# Altium project CPS.PrjPcb
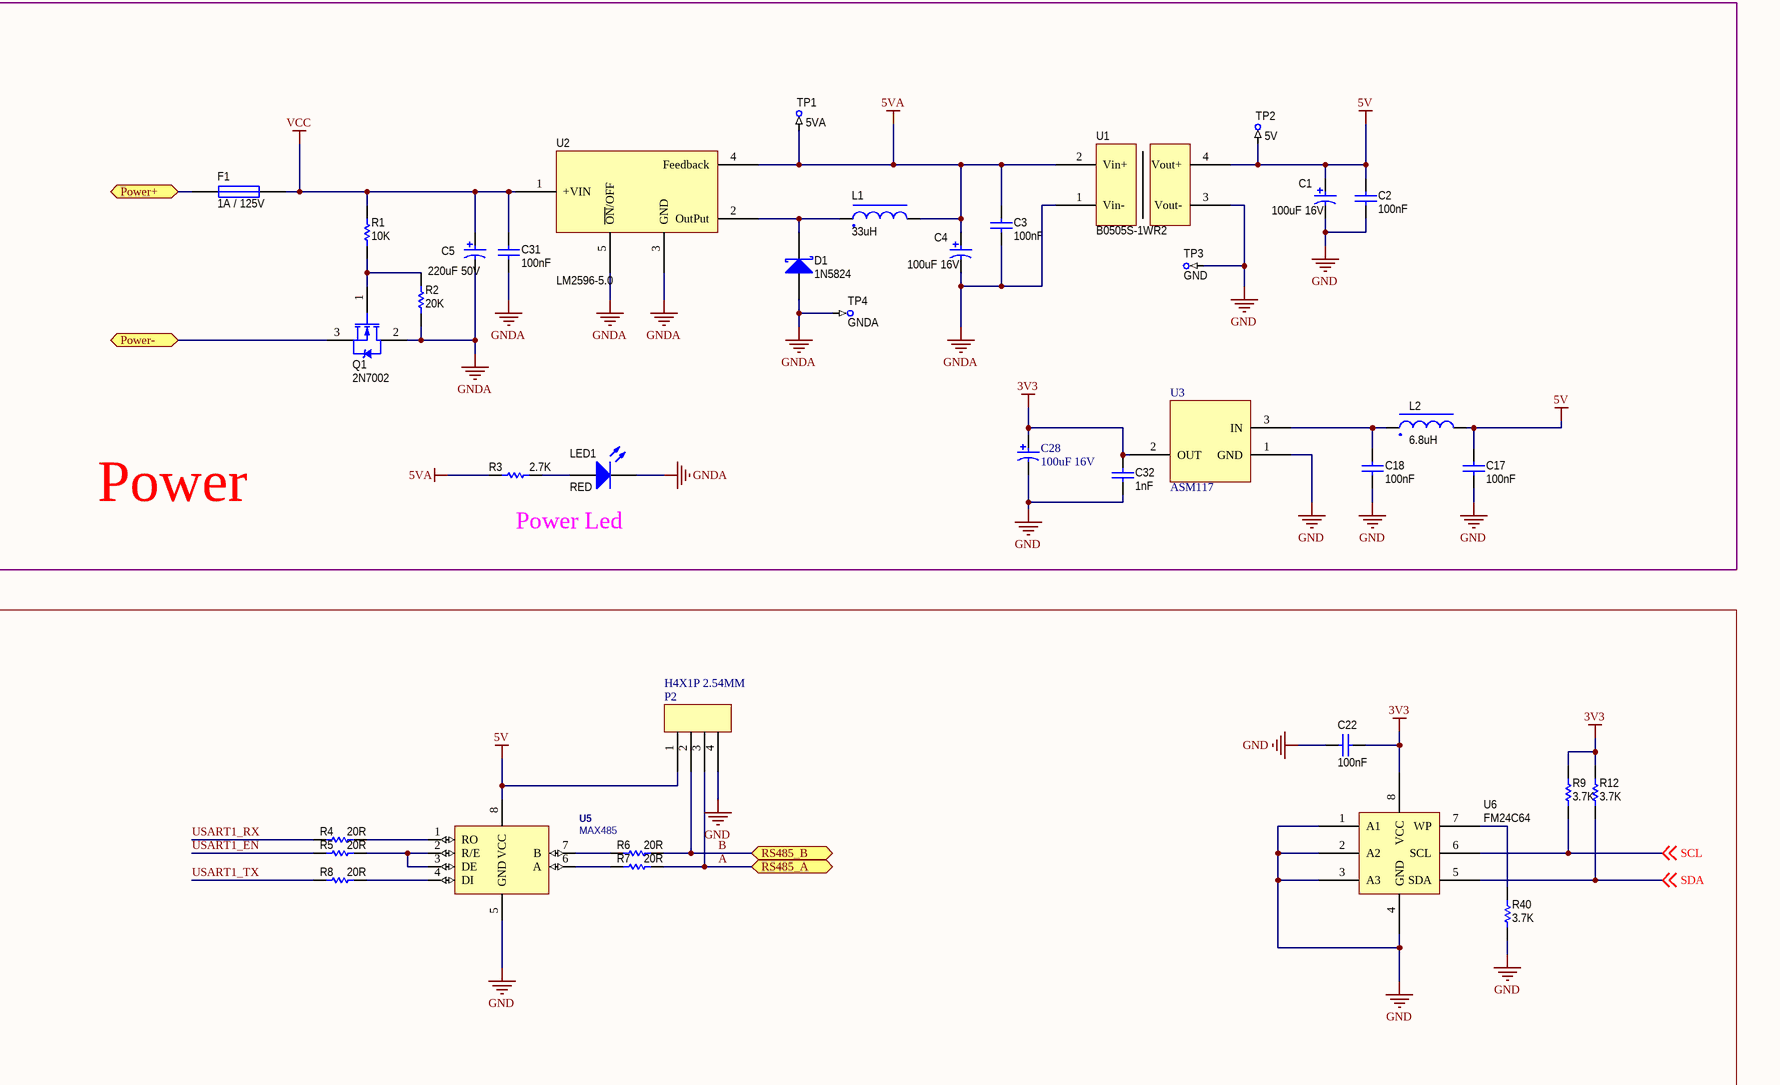
[diagram p0: CPS.SchDoc, top left]
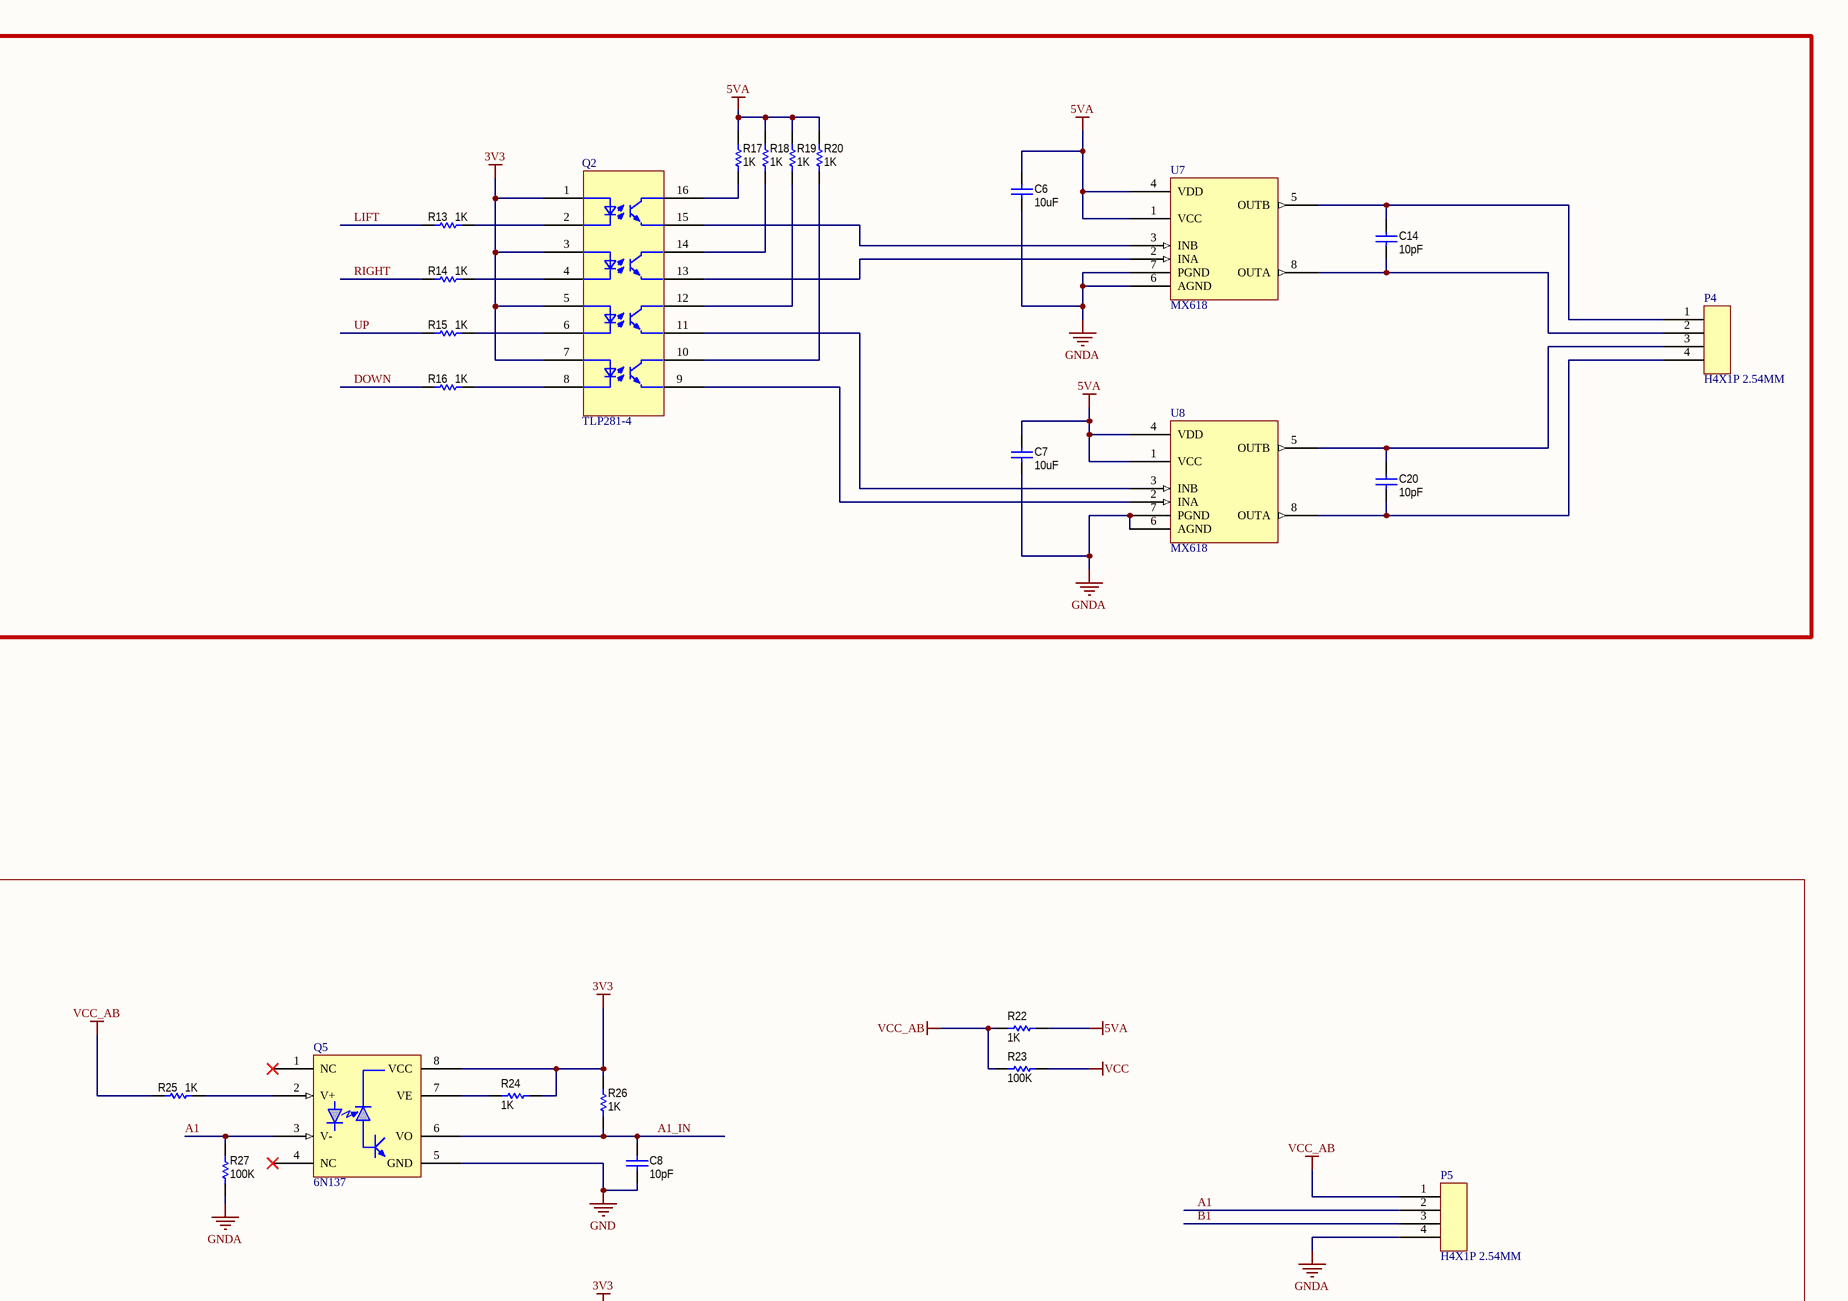
[diagram p1: CPS.SchDoc, top right]
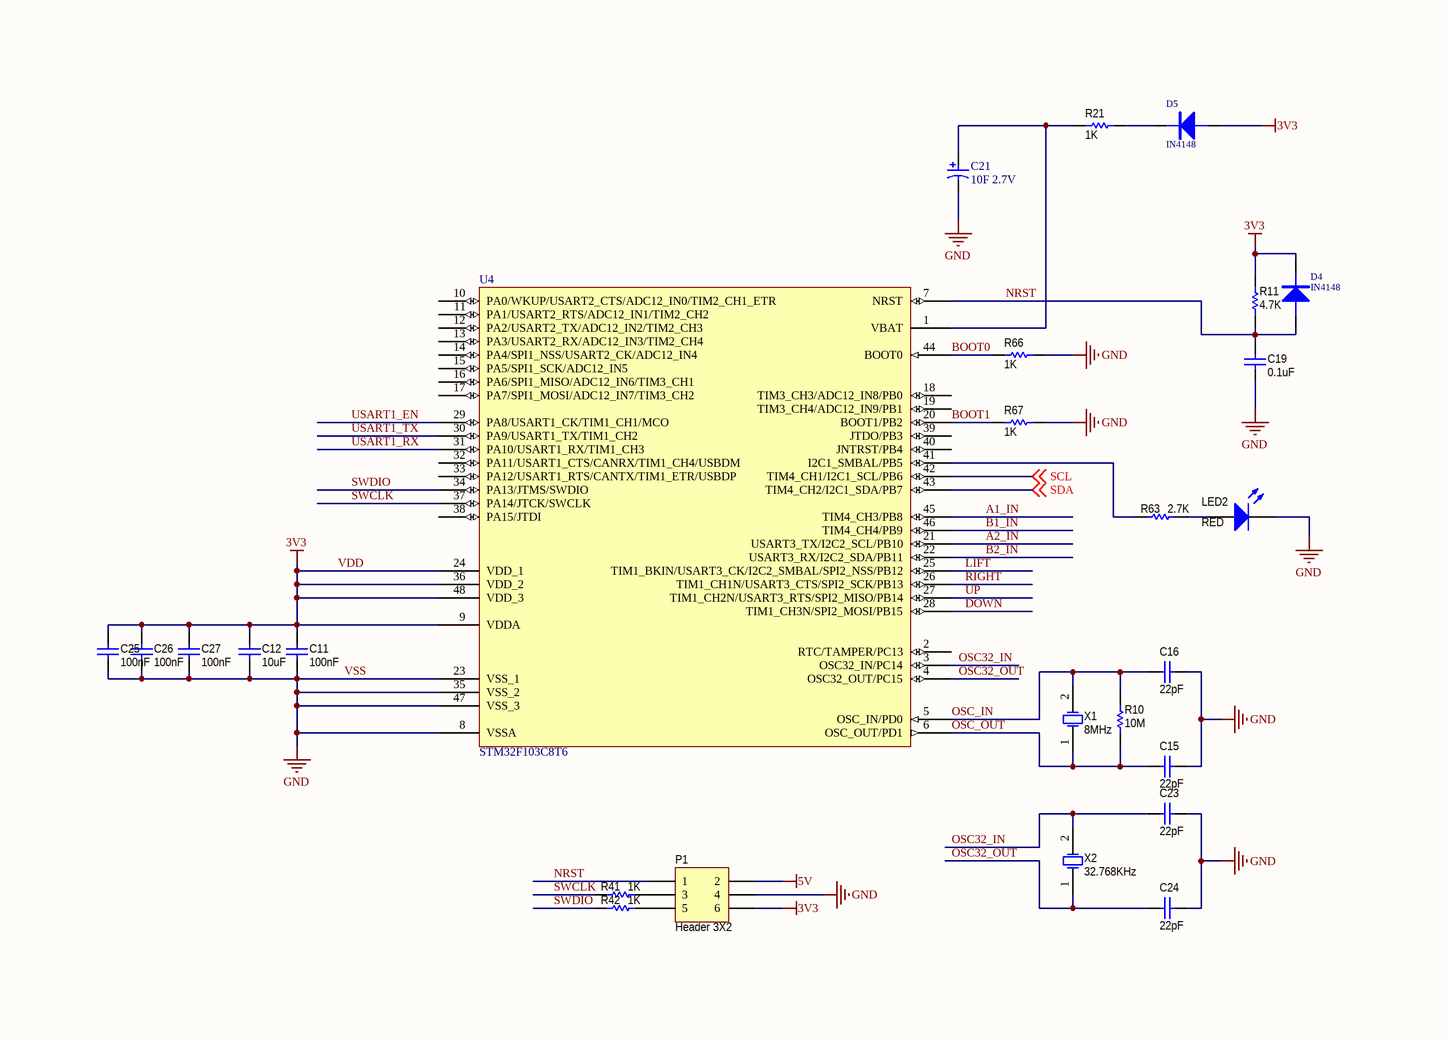
[diagram p2: CPS.SchDoc, bottom left]
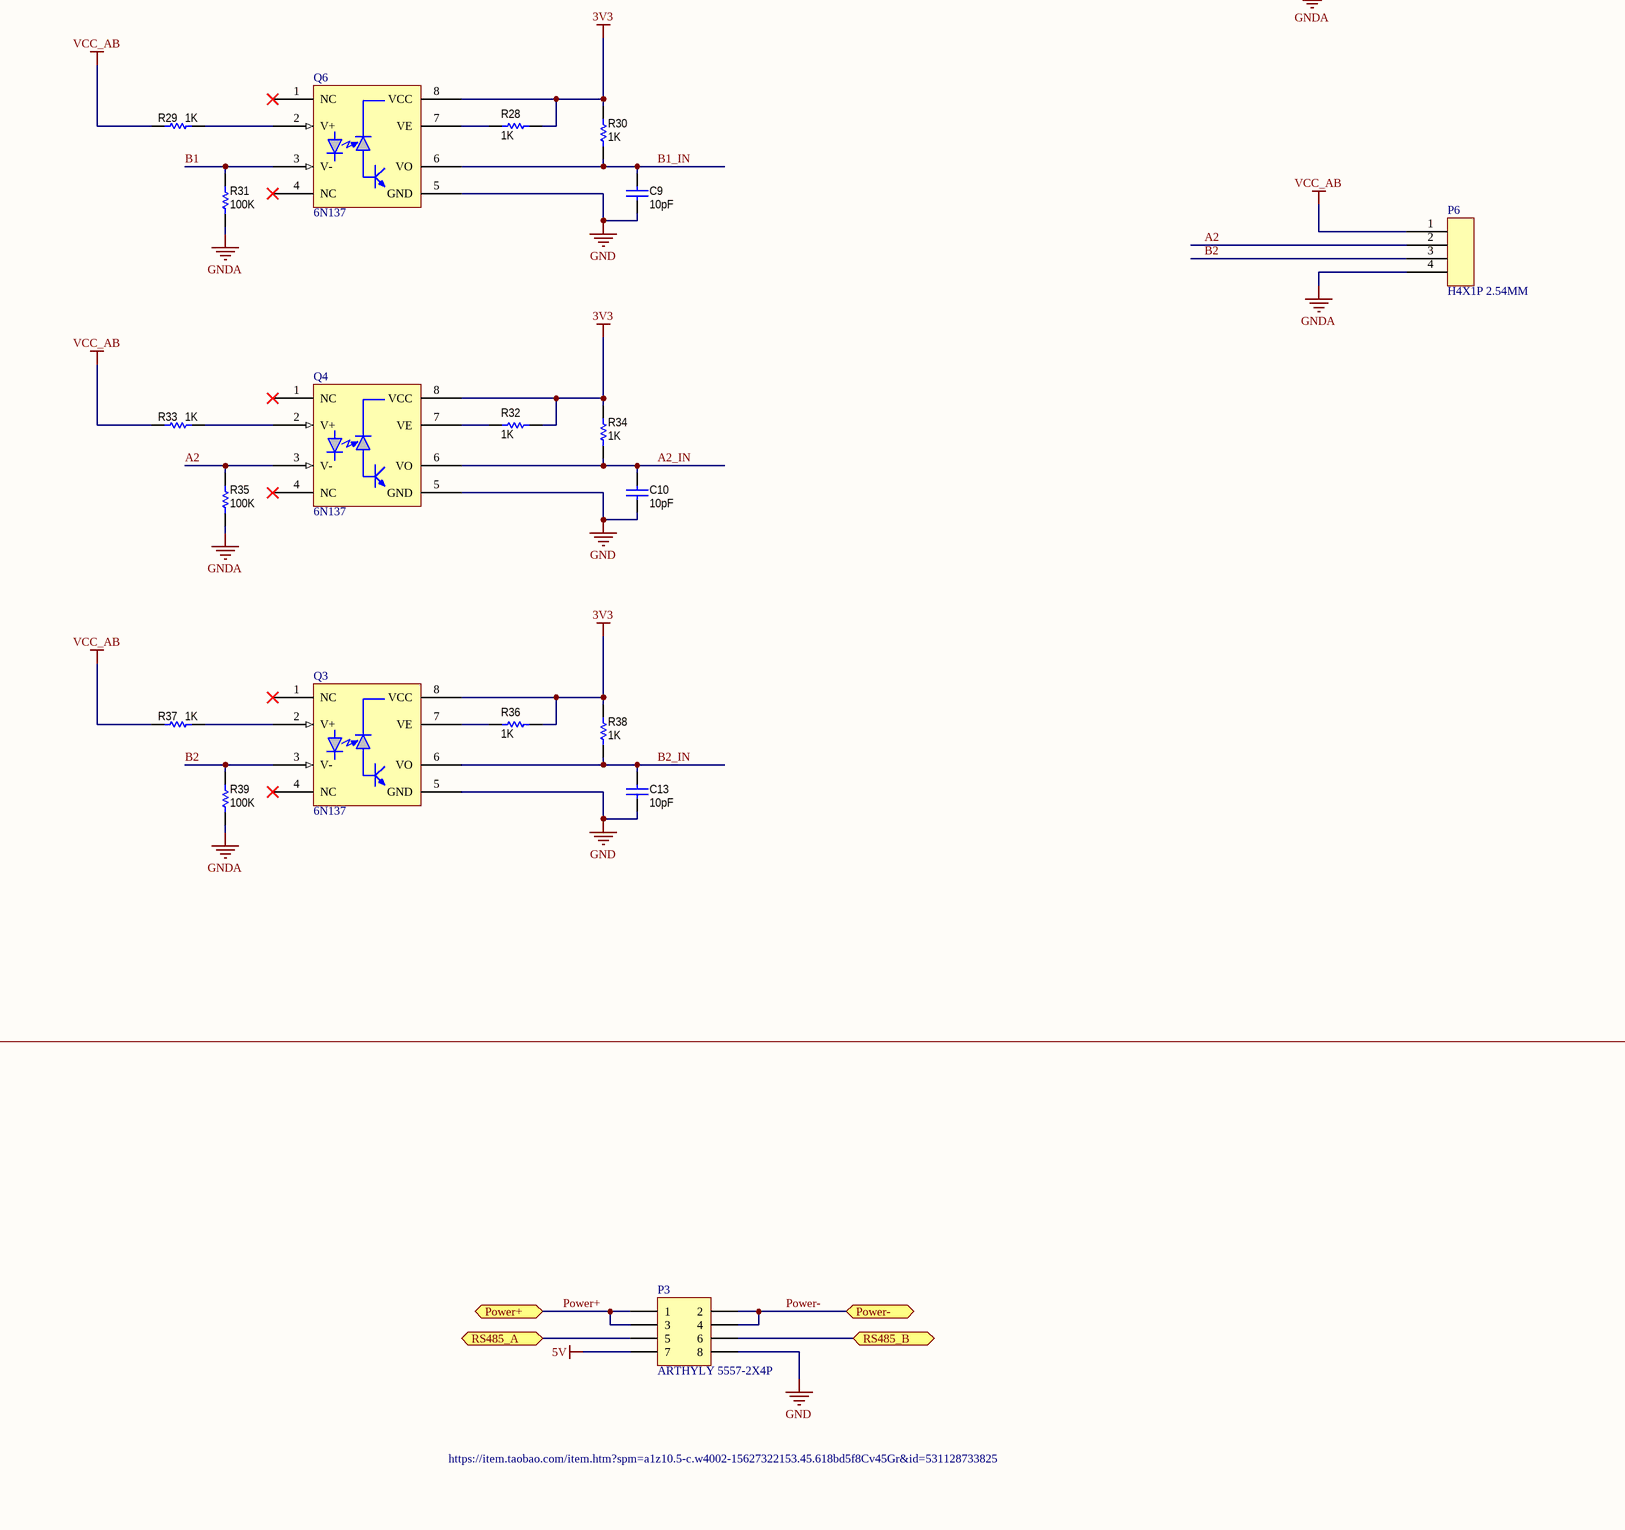
[diagram p3: CPS.SchDoc, bottom right]
1 sheet, 109 parts. Net scope: flat (ports and power ports of the same name join across sheets).
Board file: CPS.PcbDoc

## Sheet CPS.SchDoc
size A1

### Parts
C1  100uF 16V  [SMD-D6.5MM]
C2  100nF  [0603S]
C3  100nF  [0603S]
C4  100uF 16V  [SMD-D6.5MM]
C5  220uF 50V  [SMD-D10MM]
C6  10uF  [1210S]
C7  10uF  [1210S]
C8  10pF  [0805S]
C9  10pF  [0805S]
C10  10pF  [0805S]
C11  100nF  [0603S]
C12  10uF  [1210S]
C13  10pF  [0805S]
C14  10pF  [0805S]
C15  22pF  [0603S]
C16  22pF  [0603S]
C17  100nF  [0805S]
C18  100nF  [0805S]
C19  0.1uF  [0603S]
C20  10pF  [0805S]
C21  10F 2.7V  [DIP2_90_31MM]
C22  100nF  [0805S]
C23  22pF  [0603S]
C24  22pF  [0603S]
C25  100nF  [0603S]
C26  100nF  [0603S]
C27  100nF  [0603S]
C28  100uF 16V  [SMD-D6.5MM]
C31  100nF  [0805S]
C32  1nF  [0603S]
D1  1N5824  [DO-214AC]
D4  IN4148  [1206D]
D5  IN4148  [1206D]
F1  1A / 125V  [1810S]
L1  33uH  [SMD12X12X7]
L2  6.8uH  [0805S]
LED1  RED  [0805SN]
LED2  RED  [0805SN]
P1  Header 3X2  [Header3x2]
P2  H4X1P 2.54MM  [HDR1X4H-2.54MM]
P3  ARTHYLY 5557-2X4P  [5557_2X4P]
P4  H4X1P 2.54MM  [HDR1X4H-2.54MM]
P5  H4X1P 2.54MM  [HDR1X4H-2.54MM]
P6  H4X1P 2.54MM  [HDR1X4H-2.54MM]
Q1  2N7002  [TO-253]
Q2  TLP281-4  [SOP-16]
Q3  6N137  [DIP8]
Q4  6N137  [DIP8]
Q5  6N137  [DIP8]
Q6  6N137  [DIP8]
R1  10K  [0603S]
R2  20K  [0603S]
R3  2.7K  [0603S]
R4  20R  [0603S]
R5  20R  [0603S]
R6  20R  [0603S]
R7  20R  [0603S]
R8  20R  [0603S]
R9  3.7K  [0603S]
R10  10M  [0603S]
R11  4.7K  [0603S]
R12  3.7K  [0603S]
R13  1K  [0603S]
R14  1K  [0603S]
R15  1K  [0603S]
R16  1K  [0603S]
R17  1K  [0603S]
R18  1K  [0603S]
R19  1K  [0603S]
R20  1K  [0603S]
R21  1K  [1206R]
R22  1K  [1206R]
R23  100K  [1206R]
R24  1K  [0603S]
R25  1K  [0603S]
R26  1K  [0603S]
R27  100K  [0603S]
R28  1K  [0603S]
R29  1K  [0603S]
R30  1K  [0603S]
R31  100K  [0603S]
R32  1K  [0603S]
R33  1K  [0603S]
R34  1K  [0603S]
R35  100K  [0603S]
R36  1K  [0603S]
R37  1K  [0603S]
R38  1K  [0603S]
R39  100K  [0603S]
R40  3.7K  [0603S]
R41  1K  [0603S]
R42  1K  [0603S]
R63  2.7K  [0603S]
R66  1K  [0603S]
R67  1K  [0603S]
TP1  5VA  [T60]  (no BOM)
TP2  5V  [T60]  (no BOM)
TP3  GND  [T60]  (no BOM)
TP4  GNDA  [T60]  (no BOM)
U1  B0505S-1WR2  [DC/DC 2.54-4P]
U2  LM2596-5.0  [SOT-263-5]
U3  ASM117  [SOT-223]
U4  STM32F103C8T6  [LQFP-48]
U5  MAX485  [SOP-8]
U6  FM24C64  [SOP-8]
U7  MX618  [SOP-8]
U8  MX618  [SOP-8]
X1  8MHz  [5032]
X2  32.768KHz  [0805S]

### Blocks framed on the sheet
Power: C1-C5 C17 C18 C28 C31 C32 D1 F1 L1 L2 LED1 Q1 R1-R3 TP1-TP4 U1-U3

### Ports
Power+, Power-, RS485_A, RS485_B

### Nets
5V: C1.1 C2.1 C17.2 L2.2 P1.2 P2.1 P3.7 TP2.1 U1.4(Vout+) U5.8(VCC)
5VA: C3.1 C4.1 C6.2 C7.2 L1.2 R3.1 R17.1 R18.1 R19.1 R20.1 R22.2 TP1.1 U1.2(Vin+) U2.4(Feedback) U7.1(VCC) U7.4(VDD) U8.1(VCC) U8.4(VDD)
GNDA: C3.2 C4.2 C5.2 C6.1 C7.1 C31.2 D1.1(A) LED1.2(K) P5.4 P6.4 Q1.2(S) R2.2 R27.2 R31.2 R35.2 R39.2 TP4.1 U1.1(Vin-) U2.3(GND) U2.5(~{ON}/OFF) U7.6(AGND) U7.7(PGND) U8.6(AGND) U8.7(PGND)
VCC: C5.1 C31.1 F1.2 R1.2 R23.2 U2.1(+VIN)
VCC_AB: P5.1 P6.1 R22.1 R23.1 R25.2 R29.2 R33.2 R37.2
VDD: C11.2 C12.2 C22.2 C25.2 C26.2 C27.2 C28.1 C32.1 D4.2(K) D5.1(A) P1.6 Q2.1 Q2.3 Q2.5 Q2.7 Q3.8(VCC) Q4.8(VCC) Q5.8(VCC) Q6.8(VCC) R9.2 R11.1 R12.2 R24.1 R26.1 R28.1 R30.1 R32.1 R34.1 R36.1 R38.1 U3.2(OUT) U4.9(VDDA) U4.24(VDD_1) U4.36(VDD_2) U4.48(VDD_3) U6.8(VCC)  [also labelled 3V3]
VSS: C1.2 C2.2 C8.1 C9.1 C10.1 C11.1 C12.1 C13.1 C15.1 C16.1 C17.1 C18.1 C19.1 C21.2 C22.1 C23.1 C24.1 C25.1 C26.1 C27.1 C28.2 C32.2 LED2.2(K) P1.4 P2.4 P3.8 Q3.5(GND) Q4.5(GND) Q5.5(GND) Q6.5(GND) R40.1 R66.2 R67.2 TP3.1 U1.3(Vout-) U3.1(GND) U4.8(VSSA) U4.23(VSS_1) U4.35(VSS_2) U4.47(VSS_3) U5.5(GND) U6.1(A1) U6.2(A2) U6.3(A3) U6.4(GND)  [also labelled GND]
A: P2.3 P3.5 R7.2 ; port RS485_A
A1: P5.2 Q5.3(V-) R27.1
A1_IN: C8.2 Q5.6(VO) R26.2 U4.45(TIM4_CH3/PB8)
A2: P6.2 Q4.3(V-) R35.1
A2_IN: C10.2 Q4.6(VO) R34.2 U4.21(USART3_TX/I2C2_SCL/PB10)
B: P2.2 P3.6 R6.2 ; port RS485_B
B1: P5.3 Q6.3(V-) R31.1
B1_IN: C9.2 Q6.6(VO) R30.2 U4.46(TIM4_CH4/PB9)
B2: P6.3 Q3.3(V-) R39.1
B2_IN: C13.2 Q3.6(VO) R38.2 U4.22(USART3_RX/I2C2_SDA/PB11)
BOOT0: R66.1 U4.44(BOOT0)
BOOT1: R67.1 U4.20(BOOT1/PB2)
DOWN: R16.2 U4.28(TIM1_CH3N/SPI2_MOSI/PB15)
LIFT: R13.2 U4.25(TIM1_BKIN/USART3_CK/I2C2_SMBAL/SPI2_NSS/PB12)
NRST: C19.2 D4.1(A) P1.1 R11.2 U4.7(NRST)
OSC32_IN: C23.2 U4.3(OSC32_IN/PC14) X2.2(OSC2)
OSC32_OUT: C24.2 U4.4(OSC32_OUT/PC15) X2.1(OSC1)
OSC_IN: C16.2 R10.2 U4.5(OSC_IN/PD0) X1.2(OSC2)
OSC_OUT: C15.2 R10.1 U4.6(OSC_OUT/PD1) X1.1(OSC1)
Power+: F1.1 P3.1 P3.3 ; port Power+
Power-: P3.2 P3.4 Q1.3(D) ; port Power-
RIGHT: R14.2 U4.26(TIM1_CH1N/USART3_CTS/SPI2_SCK/PB13)
SCL: R9.1 U4.42(TIM4_CH1/I2C1_SCL/PB6) U6.6(SCL) ; off-sheet SCL
SDA: R12.1 U4.43(TIM4_CH2/I2C1_SDA/PB7) U6.5(SDA) ; off-sheet SDA
SWCLK: R41.1 U4.37(PA14/JTCK/SWCLK)
SWDIO: R42.1 U4.34(PA13/JTMS/SWDIO)
UP: R15.2 U4.27(TIM1_CH2N/USART3_RTS/SPI2_MISO/PB14)
USART1_EN: R5.1 U4.29(PA8/USART1_CK/TIM1_CH1/MCO)
USART1_RX: R4.1 U4.31(PA10/USART1_RX/TIM1_CH3)
USART1_TX: R8.1 U4.30(PA9/USART1_TX/TIM1_CH2)
NetC14_1: C14.1 P4.2 U7.8(OUTA)
NetC14_2: C14.2 P4.1 U7.5(OUTB)
NetC18_2: C18.2 L2.1 U3.3(IN)
NetC20_1: C20.1 P4.4 U8.8(OUTA)
NetC20_2: C20.2 P4.3 U8.5(OUTB)
NetC21_1: C21.1 R21.1 U4.1(VBAT)
NetD1_2: D1.2(K) L1.1 U2.2(OutPut)
NetD5_2: D5.2(K) R21.2
NetLED1_1: LED1.1(A) R3.2
NetLED2_1: LED2.1(A) R63.2
NetP1_3: P1.3 R41.2
NetP1_5: P1.5 R42.2
NetQ1_1: Q1.1(G) R1.1 R2.1
NetQ2_2: Q2.2 R13.1
NetQ2_4: Q2.4 R14.1
NetQ2_6: Q2.6 R15.1
NetQ2_8: Q2.8 R16.1
NetQ2_9: Q2.9 U8.2(INA)
NetQ2_10: Q2.10 R20.2
NetQ2_11: Q2.11 U8.3(INB)
NetQ2_12: Q2.12 R19.2
NetQ2_13: Q2.13 U7.2(INA)
NetQ2_14: Q2.14 R18.2
NetQ2_15: Q2.15 U7.3(INB)
NetQ2_16: Q2.16 R17.2
NetQ3_2: Q3.2(V+) R37.1
NetQ3_7: Q3.7(VE) R36.2
NetQ4_2: Q4.2(V+) R33.1
NetQ4_7: Q4.7(VE) R32.2
NetQ5_2: Q5.2(V+) R25.1
NetQ5_7: Q5.7(VE) R24.2
NetQ6_2: Q6.2(V+) R29.1
NetQ6_7: Q6.7(VE) R28.2
NetR4_2: R4.2 U5.1(RO)
NetR5_2: R5.2 U5.2(R/E) U5.3(DE)
NetR6_1: R6.1 U5.7(B)
NetR7_1: R7.1 U5.6(A)
NetR8_2: R8.2 U5.4(DI)
NetR40_2: R40.2 U6.7(WP)
NetR63_1: R63.1 U4.41(I2C1_SMBAL/PB5)

Not connected (* = marked no-connect by the designer): Q3 1(NC)* 4(NC)*; Q4 1(NC)* 4(NC)*; Q5 1(NC)* 4(NC)*; Q6 1(NC)* 4(NC)*; U4 2(RTC/TAMPER/PC13) 10(PA0/WKUP/USART2_CTS/ADC12_IN0/TIM2_CH1_ETR) 11(PA1/USART2_RTS/ADC12_IN1/TIM2_CH2) 12(PA2/USART2_TX/ADC12_IN2/TIM2_CH3) 13(PA3/USART2_RX/ADC12_IN3/TIM2_CH4) 14(PA4/SPI1_NSS/USART2_CK/ADC12_IN4) 15(PA5/SPI1_SCK/ADC12_IN5) 16(PA6/SPI1_MISO/ADC12_IN6/TIM3_CH1) 17(PA7/SPI1_MOSI/ADC12_IN7/TIM3_CH2) 18(TIM3_CH3/ADC12_IN8/PB0) 19(TIM3_CH4/ADC12_IN9/PB1) 32(PA11/USART1_CTS/CANRX/TIM1_CH4/USBDM) 33(PA12/USART1_RTS/CANTX/TIM1_ETR/USBDP) 38(PA15/JTDI) 39(JTDO/PB3) 40(JNTRST/PB4)

### Notes on the sheet
- Power Led
- https://item.taobao.com/item.htm?spm=a1z10.5-c.w4002-15627322153.45.618bd5f8Cv45Gr&id=531128733825

### Library data of the parts
C1 C4 C5 C21 C28 = CAP-P: Polar Capacitor; Design Item Id: CAP-P-10uF-16V-MCCT-B
C2 C3 C6-C20 C22-C27 C32 = CAP-NP: Capacitor; Value: 16V; Design Item Id: CAP-NP-100nF-16V-0603
C31 = CAP-NP: Capacitor; Value: 50V; Design Item Id: CAP-NP-100nF-16V-0603
D1 = DIO-SCHOTTKY-1S-SOT23: Schottky Barrier Double Diode; Design Item Id: DIO-SCHOTTKY-1S-SOT23
D4 D5 = DIO_SWITCH: Silicon Epitaxial Planar Switching Diode,75V
F1 = Fuse 1: Fuse; Published: 8-Jun-2000; LatestRevisionDate: 17-Jul-2002; LatestRevisionNote: Re-released for DXP Platform.; PackageReference: PIN-W2/E2.8; Publisher: Altium Limited
L1 = Inductor_1: Value: CDRH127R 12*12*7MM
L2 = Inductor_1: Value: 0805S
LED1 LED2 = DIO-LED-1S: Typical GREEN SMD LED Agilent make; Design Item Id: LED-RED-HSMHC170
P1 = Header 3X2: Header, 3-Pin, Dual row; LatestRevisionDate: 17-Jul-2002; LatestRevisionNote: Re-released for DXP Platform.; Publisher: Altium Limited
P2 P4-P6 = H4X1P
P3 = Header 4X2: Header, 4-Pin, Dual row; LatestRevisionDate: 17-Jul-2002; LatestRevisionNote: Re-released for DXP Platform.; Publisher: Altium Limited
Q1 = NMOS: N-Channel MOSFET
Q2 = Optocoupler 4Pass: TLP281-4 TOSHIBA PHOTOCOUPLER GaAs IRED & PHOTO-TRANSISTOR; Value: 80V,Current transfer Radio 50%
R1-R3 R10 R11 R63 = RES: Resistor; Value: 5%,1/10W,0603
R4-R9 R12-R42 R66 R67 = RES: Resistor; Value: 0.1%,1/10W,0603
TP1-TP4 = TestPin: Design Item Id: TestPin
U1 = DC/DC: MORNSUN DC/DC; Value: DC5V,1W,1500VDC,SIP/DIP
U2 = LM2596-5.0: LM2596 SIMPLE SWITCHER? Power Converter 150-kHz  3-A Step-Down Voltage Regulator; Value: 5-V
U4 = STM32F103C8T6: ST MCU,STM32F103C8T6,64Kb Flash,20Kb RAM
U5 = RS485: MAXIM,RS-485/RS-422 Transceivers
U6 = F24CXX: FM24C64,8K FLASH,IIC; Value: FM24C64
U7 U8 = MX618: DC 2V-9.6V Motor Contl
X1 X2 = XTAL: Crystal Oscillator; Published: 8-Jun-2000; LatestRevisionDate: 17-Jul-2002; LatestRevisionNote: Re-released for DXP Platform.; PackageReference: R38; Publisher: Altium Limited